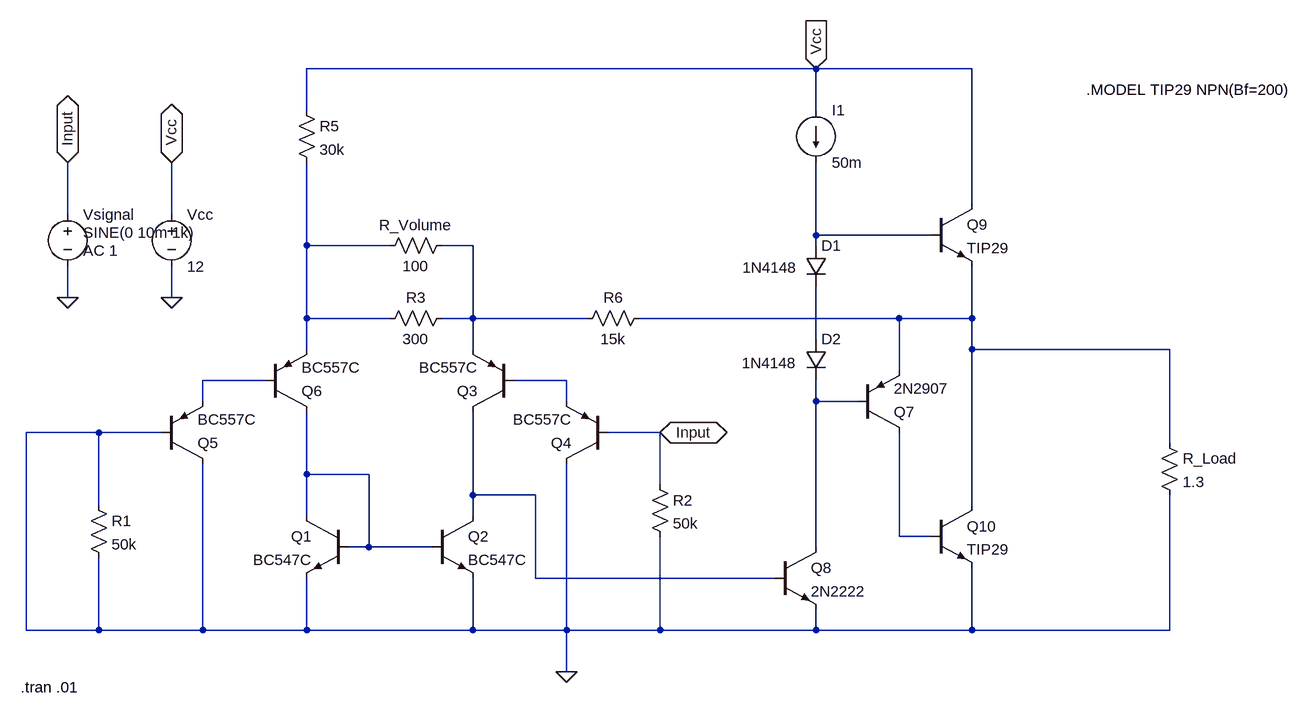
[diagram p0: schematic P3 - 2020 - LM386.asc]
P3 - 2020 - LM386.asc, the LTspice schematic file:
Version 4
SHEET 1 2536 680
WIRE 864 -544 80 -544
WIRE 1104 -544 864 -544
WIRE 80 -480 80 -544
WIRE 864 -480 864 -544
WIRE 1104 -336 1104 -544
WIRE -288 -320 -288 -400
WIRE -128 -320 -128 -400
WIRE 864 -288 864 -400
WIRE 1040 -288 864 -288
WIRE 80 -272 80 -400
WIRE 208 -272 80 -272
WIRE 336 -272 288 -272
WIRE 864 -272 864 -288
WIRE -288 -192 -288 -240
WIRE -128 -192 -128 -240
WIRE 80 -160 80 -272
WIRE 208 -160 80 -160
WIRE 336 -160 336 -272
WIRE 336 -160 288 -160
WIRE 512 -160 336 -160
WIRE 992 -160 592 -160
WIRE 1104 -160 1104 -240
WIRE 1104 -160 992 -160
WIRE 864 -128 864 -208
WIRE 80 -112 80 -160
WIRE 336 -112 336 -160
WIRE 1104 -112 1104 -160
WIRE 1408 -112 1104 -112
WIRE 992 -80 992 -160
WIRE 16 -64 -80 -64
WIRE 480 -64 400 -64
WIRE -80 -32 -80 -64
WIRE 480 -32 480 -64
WIRE 864 -32 864 -64
WIRE 928 -32 864 -32
WIRE -240 16 -352 16
WIRE -144 16 -240 16
WIRE 624 16 544 16
WIRE 1408 32 1408 -112
WIRE 80 80 80 -16
WIRE 176 80 80 80
WIRE 624 96 624 16
WIRE 336 112 336 -16
WIRE 432 112 336 112
WIRE -240 128 -240 16
WIRE 1104 128 1104 -112
WIRE 80 144 80 80
WIRE 336 144 336 112
WIRE 992 176 992 16
WIRE 1040 176 992 176
WIRE 176 192 176 80
WIRE 176 192 144 192
WIRE 272 192 176 192
WIRE 864 192 864 -32
WIRE 432 240 432 112
WIRE 800 240 432 240
WIRE -352 320 -352 16
WIRE -240 320 -240 208
WIRE -240 320 -352 320
WIRE -80 320 -80 64
WIRE -80 320 -240 320
WIRE 80 320 80 240
WIRE 80 320 -80 320
WIRE 336 320 336 240
WIRE 336 320 80 320
WIRE 480 320 480 64
WIRE 480 320 336 320
WIRE 624 320 624 176
WIRE 624 320 480 320
WIRE 864 320 864 288
WIRE 864 320 624 320
WIRE 1104 320 1104 224
WIRE 1104 320 864 320
WIRE 1408 320 1408 112
WIRE 1408 320 1104 320
WIRE 480 384 480 320
FLAG 624 16 Input
IOPIN 624 16 BiDir
FLAG 480 384 0
FLAG -288 -192 0
FLAG -288 -400 Input
IOPIN -288 -400 BiDir
FLAG -128 -192 0
FLAG -128 -400 Vcc
IOPIN -128 -400 BiDir
FLAG 864 -544 Vcc
IOPIN 864 -544 In
SYMBOL npn 144 144 M0
SYMATTR InstName Q1
SYMATTR Value BC547C
SYMBOL npn 272 144 R0
SYMATTR InstName Q2
SYMATTR Value BC547C
SYMBOL pnp 400 -16 R180
SYMATTR InstName Q3
SYMATTR Value BC557C
SYMBOL pnp 544 64 R180
SYMATTR InstName Q4
SYMATTR Value BC557C
SYMBOL pnp -144 64 M180
SYMATTR InstName Q5
SYMATTR Value BC557C
SYMBOL pnp 16 -16 M180
SYMATTR InstName Q6
SYMATTR Value BC557C
SYMBOL pnp 928 16 M180
SYMATTR InstName Q7
SYMATTR Value 2N2907
SYMBOL npn 800 192 R0
SYMATTR InstName Q8
SYMATTR Value 2N2222
SYMBOL diode 848 -272 R0
WINDOW 3 -97 34 Left 2
SYMATTR Value 1N4148
SYMATTR InstName D1
SYMBOL diode 848 -128 R0
WINDOW 3 -98 37 Left 2
SYMATTR Value 1N4148
SYMATTR InstName D2
SYMBOL res -256 112 R0
SYMATTR InstName R1
SYMATTR Value 50k
SYMBOL res 608 80 R0
SYMATTR InstName R2
SYMATTR Value 50k
SYMBOL res 304 -176 R90
WINDOW 0 0 56 VBottom 2
WINDOW 3 32 56 VTop 2
SYMATTR InstName R3
SYMATTR Value 300
SYMBOL res 64 -496 R0
SYMATTR InstName R5
SYMATTR Value 30k
SYMBOL current 864 -480 R0
WINDOW 123 0 0 Left 0
WINDOW 39 0 0 Left 0
SYMATTR InstName I1
SYMATTR Value 50m
SYMBOL voltage -288 -336 R0
WINDOW 3 24 44 Left 2
WINDOW 123 24 72 Left 2
WINDOW 39 0 0 Left 0
SYMATTR Value SINE(0 10m 1k)
SYMATTR Value2 AC 1
SYMATTR InstName Vsignal
SYMBOL voltage -128 -336 R0
WINDOW 123 0 0 Left 0
WINDOW 39 0 0 Left 0
SYMATTR InstName Vcc
SYMATTR Value 12
SYMBOL res 608 -176 R90
WINDOW 0 0 56 VBottom 2
WINDOW 3 32 56 VTop 2
SYMATTR InstName R6
SYMATTR Value 15k
SYMBOL res 1392 16 R0
SYMATTR InstName R_Load
SYMATTR Value 1.3
SYMBOL npn 1040 -336 R0
SYMATTR InstName Q9
SYMATTR Value TIP29
SYMBOL npn 1040 128 R0
SYMATTR InstName Q10
SYMATTR Value TIP29
SYMBOL res 304 -288 R90
WINDOW 0 0 56 VBottom 2
WINDOW 3 32 56 VTop 2
SYMATTR InstName R_Volume
SYMATTR Value 100
TEXT -360 408 Left 2 !.tran .01
TEXT 1280 -512 Left 2 !.MODEL TIP29 NPN(Bf=200)

The netlist it stands for:
* P3 - 2020 - LM386.asc
Q1 N009 N009 0 0 BC547C
Q2 N010 N009 0 0 BC547C
Q3 N010 N007 N003 0 BC557C
Q4 0 Input N007 0 BC557C
Q5 0 0 N006 0 BC557C
Q6 N009 N006 N002 0 BC557C
Q7 N011 N008 N004 0 2N2907
Q8 N008 N010 0 0 2N2222
D1 N001 N005 1N4148
D2 N005 N008 1N4148
R1 0 0 50k
R2 Input 0 50k
R3 N003 N002 300
R5 Vcc N002 30k
I1 Vcc N001 50m
Vsignal Input 0 SINE(0 10m 1k) AC 1
Vcc Vcc 0 12
R6 N004 N003 15k
R_Load N004 0 1.3
Q9 Vcc N001 N004 0 TIP29
Q10 N004 N011 0 0 TIP29
R_Volume N003 N002 100
.model D D
.lib standard.dio
.model NPN NPN
.model PNP PNP
.lib standard.bjt
.tran .01
.MODEL TIP29 NPN(Bf=200)
.backanno
.end